# Altium schematic sheet 00_Block_Diagram.SchDoc: Block Diagram
size A4; DrawnBy: Micls; SheetNumber: 1; SheetTotal: 2
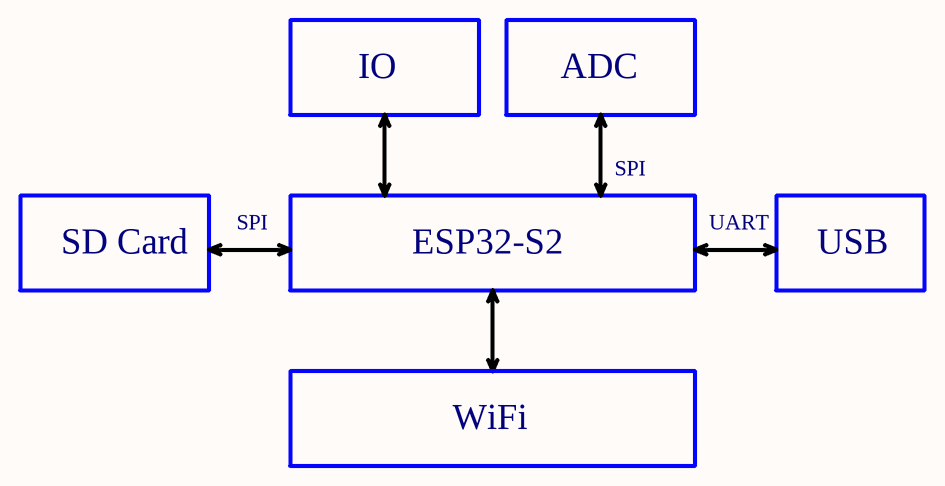
[diagram p0: 00_Block_Diagram.SchDoc]

## Notes on the sheet
- IO
- ADC
- SPI
- UART
- SD Card
- ESP32-S2
- USB
- WiFi
- APPROVALS
- DATE
- PROJECT
- BOM:
- REFERENCE DOCUMENTS
- TITLE
- PROJECT REVISION
- DOCUMENT REVISION
- ASSY DWG:
- FAB DWG:
- PCB DWG:
- SIZE:
- Drawn by:
- A4
- FILE NAME:
- Checked by:
- Date:
- REV
- SHEET
- Time:
- OF